# Altium project LDO_breakout_board.PrjPcb
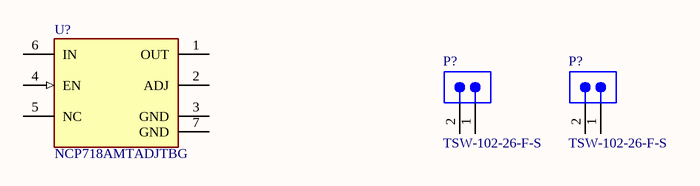
[diagram p0: LDO_breakout_schematic.SchDoc]
1 sheet, 3 parts. Net scope: global (net labels, ports and power ports of the same name join across sheets).
Board file: LDO_PCB.PcbDoc

## Sheet LDO_breakout_schematic.SchDoc: LDO Breakout Board
size A4; Author: Mark Toth, Andrei Enache; CompanyName: DTU; Revision: R1; SheetNumber: 1; SheetTotal: 1

### Parts
(Parts that share a designator on the sheet are numbered #1, #2 ... from top to bottom, then left to right.)
P?#1  TSW-102-26-F-S  [SMTC-TSW-102-26-XX-S]
P?#2  TSW-102-26-F-S  [SMTC-TSW-102-26-XX-S]
U?  NCP718AMTADJTBG  [FP-511BR-MFG]

### Nets

Not connected (* = marked no-connect by the designer): P?#1 1 2; P?#2 1 2; U? 1(OUT) 2(ADJ) 3(GND) 4(EN) 5(NC) 6(IN) 7(GND)

### Library data of the parts
P?#1 P?#2 = CMP-1024-00329-1: 0.025" SQ Post Header, Through-hole, Vertical, -55 to 125 degC, 2.54 mm Pitch, 2-Pin, Male, RoHS; Manufacturer: Samtec; Pitch: 2.54 mm; PackageVersion: DM, 8/1988; ComponentLink2Description: Datasheet; PackageReference: TSW-102-26-XX-S; ComponentLink3URL: http://www.samtec.com/documents/webfiles/cpdf/TSW-XXX-XX-XXX-X-XX-XXX-MKT.pdf; ComponentLink2URL: http://www.samtec.com/documents/webfiles/pdf/TSW_TH.PDF; ComponentLink1Description: Manufacturer URL; DatasheetVersion: F-214; RoHS: True; ComponentLink3Description: Package Specification; PartNumber: TSW-102-26-F-S; Temperature Range: -55 to 125 degC; Orientation: Vertical; ComponentLink1URL: http://www.samtec.com; PackageDescription: .025[0.64] SQ. Post Terminal Strip Assembly; Mounting Technology: Through-hole
U? = CMP-00278-87159789-1: NCP718AMTADJTBG LDO Regulator, 300 mA, Wide Vin, Ultra-Low Iq Adjustable, Active Discharge, WDFN6; Output Current: 300mA; Number of Outputs: 1; Max Supply Voltage: 24V; Dropout Voltage: 490mV; Nominal Supply Current: 4µA; Min Supply Voltage: 2.5V; Max Junction Temperature (Tj): 150°C; Accuracy: 2%; Max Operating Temperature: 150°C; Output Type: Adjustable; Height: 800µm; RoHS: Compliant; Manufacturer Lifecycle Status: ACTIVE; Number of Channels: 1; NexarPartId: 87159789; Schedule B: 8542390000, 8542390000; Lifecycle Status: Production